# Altium schematic sheet Earphone-1.SchDoc
size A4
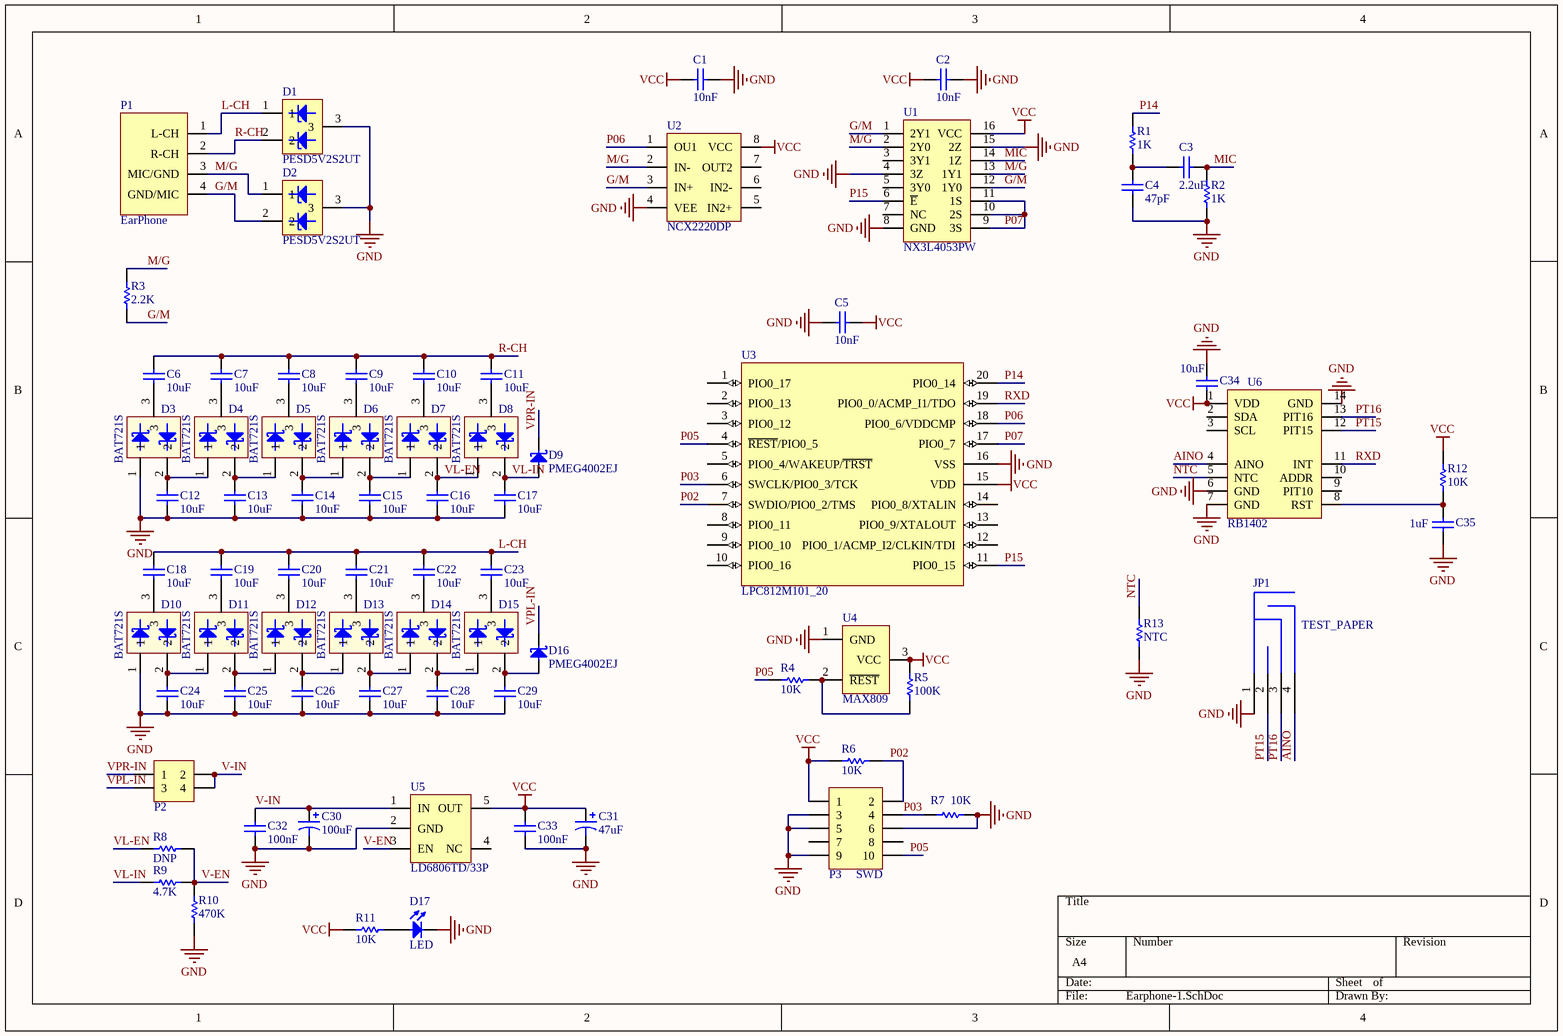
[diagram p0: Earphone-1.SchDoc]

## Parts
C1  10nF  [0402C]
C2  10nF  [0402C]
C3  2.2uF  [0402C]
C4  47pF  [0402C]
C5  10nF  [0402C]
C6  10uF  [0402C]
C7  10uF  [0402C]
C8  10uF  [0402C]
C9  10uF  [0402C]
C10  10uF  [0402C]
C11  10uF  [0402C]
C12  10uF  [0402C]
C13  10uF  [0402C]
C14  10uF  [0402C]
C15  10uF  [0402C]
C16  10uF  [0402C]
C17  10uF  [0402C]
C18  10uF  [0402C]
C19  10uF  [0402C]
C20  10uF  [0402C]
C21  10uF  [0402C]
C22  10uF  [0402C]
C23  10uF  [0402C]
C24  10uF  [0402C]
C25  10uF  [0402C]
C26  10uF  [0402C]
C27  10uF  [0402C]
C28  10uF  [0402C]
C29  10uF  [0402C]
C30  100uF  [T3216-18[A]]
C31  47uF  [T3216-18[A]]
C32  100nF  [0402C]
C33  100nF  [0402C]
C34  10uF  [0402C]
C35  1uF  [0402C]
D1  PESD5V2S2UT  [SOT23]
D2  PESD5V2S2UT  [SOT23]
D3  BAT721S  [SOT23]
D4  BAT721S  [SOT23]
D5  BAT721S  [SOT23]
D6  BAT721S  [SOT23]
D7  BAT721S  [SOT23]
D8  BAT721S  [SOT23]
D9  PMEG4002EJ  [SOD323]
D10  BAT721S  [SOT23]
D11  BAT721S  [SOT23]
D12  BAT721S  [SOT23]
D13  BAT721S  [SOT23]
D14  BAT721S  [SOT23]
D15  BAT721S  [SOT23]
D16  PMEG4002EJ  [SOD323]
D17  LED  [0603L]
JP1  TEST_PAPER  [TEST_PAPER]
P1  EarPhone  [EarPhone]
P2  Header-2X2  [header-2x2(2.54)]  (value not drawn)
P3  SWD  [header-2x5(2.54)]
R1  1K  [0402R]
R2  1K  [0402R]
R3  2.2K  [0402R]
R4  10K  [0402R]
R5  100K  [0402R]
R6  10K  [0402R]
R7  10K  [0402R]
R8  DNP  [0402R]
R9  4.7K  [0402R]
R10  470K  [0402R]
R11  10K  [0402R]
R12  10K  [0402R]
R13  NTC  [0603R]
U1  NX3L4053PW  [TSSOP16]
U2  NCX2220DP  [TSSOP8]
U3  LPC812M101_20  [TSSOP20]
U4  MAX809  [SOT23]
U5  LD6806TD/33P  [SOT753 (TSOP5)]
U6  RB1402  [RB1402]

## Nets
GND: C1.1 C2.2 C4.1 C5.1 C12.1 C13.1 C14.1 C15.1 C16.1 C17.1 C24.1 C25.1 C26.1 C27.1 C28.1 C29.1 C30.2 C31.2 C32.1 C33.1 C34.2 C35.1 D1.3 D2.3 D3.1 D10.1 D17.2(K) JP1.1(N) P3.3 P3.5 P3.6 P3.9 R2.2 R7.2 R10.1 R13.1 U1.4(3Z) U1.8(GND) U1.15(2Z) U2.4(VEE) U3.16(VSS) U4.1(GND) U5.2(GND) U6.6(GND) U6.7(GND) U6.14(GND)
VCC: C1.2 C2.1 C5.2 C31.1 C33.2 C34.1 P3.1 R5.2 R6.1 R11.1 R12.2 U1.16(VCC) U2.8(VCC) U3.15(VDD) U4.3(VCC) U5.5(OUT) U6.1(VDD)
AINO: JP1.4(P) U6.4(AINO)
G/M: D2.2 P1.4(GND/MIC) R3.1 U1.1(2Y1) U1.12(1Y0) U2.3(IN+)
L-CH: C18.2 C19.2 C20.2 C21.2 C22.2 C23.2 D1.1 P1.1(L-CH)
M/G: D2.1 P1.3(MIC/GND) R3.2 U1.2(2Y0) U1.13(1Y1) U2.2(IN-)
MIC: C3.1 R2.1 U1.14(1Z)
NTC: R13.2 U6.5(NTC)
P02: P3.2 R6.2 U3.7(SWDIO/PIO0_2/TMS)
P03: P3.4 R7.1 U3.6(SWCLK/PIO0_3/TCK)
P05: P3.10 R4.1 U3.4(~{REST}/PIO0_5)
P06: U2.1(OU1) U3.18(PIO0_6/VDDCMP)
P07: U1.9(3S) U1.10(2S) U1.11(1S) U3.17(PIO0_7)
P14: R1.1 U3.20(PIO0_14)
P15: U1.6(~{E}) U3.11(PIO0_15)
PT15: JP1.2(PC10) U6.12(PIT15)
PT16: JP1.3(NOP) U6.13(PIT16)
R-CH: C6.2 C7.2 C8.2 C9.2 C10.2 C11.2 D1.2 P1.2(R-CH)
RXD: U3.19(PIO0_0/ACMP_I1/TDO) U6.11(INT)
V-EN: R8.2 R9.2 R10.2 U5.3(EN)
V-IN: C30.1 C32.2 P2.2 P2.4 U5.1(IN)
VL-EN: C16.2 D7.2 D8.1 R8.1
VL-IN: C17.2 D8.2 D9.2 R9.1
VPL-IN: D16.1 P2.3
VPR-IN: D9.1 P2.1
NetC3_2: C3.2 C4.2 R1.2
NetC6_1: C6.1 D3.3
NetC7_1: C7.1 D4.3
NetC8_1: C8.1 D5.3
NetC9_1: C9.1 D6.3
NetC10_1: C10.1 D7.3
NetC11_1: C11.1 D8.3
NetC12_2: C12.2 D3.2 D4.1
NetC13_2: C13.2 D4.2 D5.1
NetC14_2: C14.2 D5.2 D6.1
NetC15_2: C15.2 D6.2 D7.1
NetC18_1: C18.1 D10.3
NetC19_1: C19.1 D11.3
NetC20_1: C20.1 D12.3
NetC21_1: C21.1 D13.3
NetC22_1: C22.1 D14.3
NetC23_1: C23.1 D15.3
NetC24_2: C24.2 D10.2 D11.1
NetC25_2: C25.2 D11.2 D12.1
NetC26_2: C26.2 D12.2 D13.1
NetC27_2: C27.2 D13.2 D14.1
NetC28_2: C28.2 D14.2 D15.1
NetC29_2: C29.2 D15.2 D16.2
NetC35_2: C35.2 R12.1 U6.8(RST)
NetD17_1: D17.1(A) R11.2
NetR4_2: R4.2 R5.1 U4.2(~{REST})

Not connected (* = marked no-connect by the designer): P3 7 8; U1 3(3Y1) 5(3Y0) 7(NC); U2 5(IN2+) 6(IN2-) 7(OUT2); U3 1(PIO0_17) 2(PIO0_13) 3(PIO0_12) 5(PIO0_4/WAKEUP/~{TRST}) 8(PIO0_11) 9(PIO0_10) 10(PIO0_16) 12(PIO0_1/ACMP_I2/CLKIN/TDI) 13(PIO0_9/XTALOUT) 14(PIO0_8/XTALIN); U5 4(NC); U6 2(SDA) 3(SCL) 9(PIT10) 10(ADDR)

## Library data of the parts
C1-C29 C32-C35 = CAP
C30 C31 = CAP POL2
D1 D2 = PESD5V2S2UT: SOT23
D3-D8 D10-D15 = BAT721S: SOT23
D9 D16 = PMEG4002EJ: SOD323F
P3 = Header-2X5
R1-R13 = RES
U1 = NX3L4053PW: TSSOP16(SOT403-1)
U2 = NCX2220DP: TSSOP8(SOT505-2)
U3 = LPC812M101_20: TSSOP20
U4 = MAX809: SOT23
U5 = LD6806TD/33P: TSOP5(SOT753)